# Altium schematic sheet V3s.SchDoc: V3s 原理图
size A3; Address1: 原理图 吴国才; Address2: PCB 吴国才; DocumentNumber: 3; Revision: V1.0; SheetNumber: 3; SheetTotal: 3
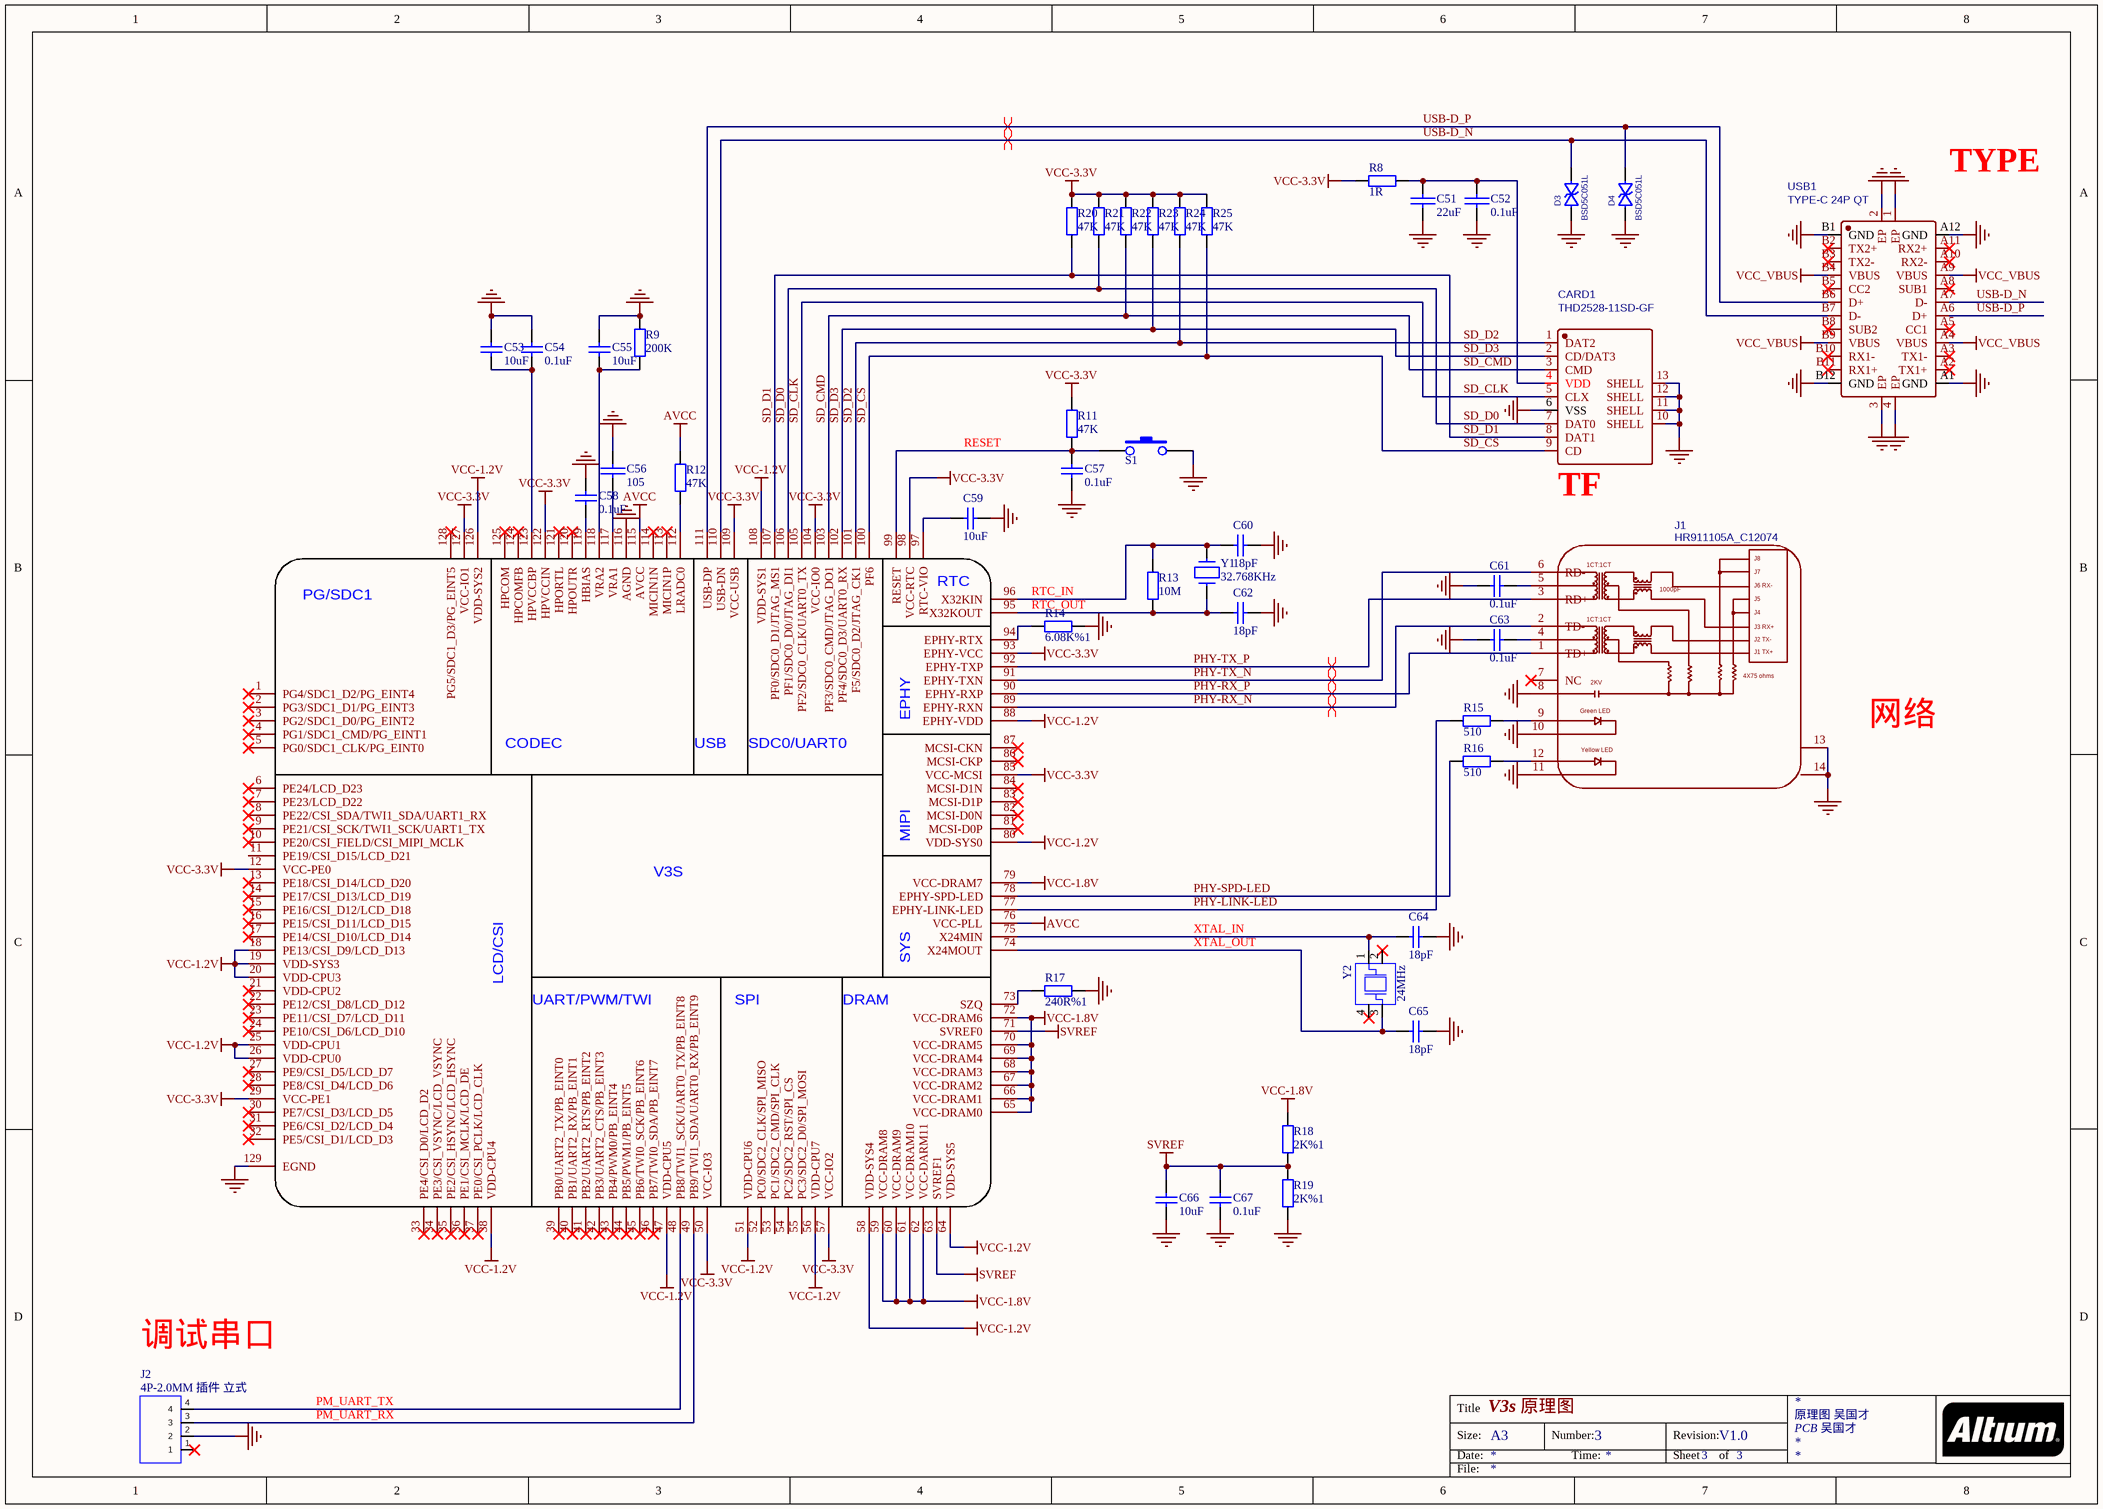
[diagram p0: V3s.SchDoc]

## Parts
C51  22uF  [0805_C]
C52  0.1uF  [0402_C]
C53  10uF  [0603_C]
C54  0.1uF  [0402_C]
C55  10uF  [0603_C]
C56  105  [0402_C]
C57  0.1uF  [0402_C]
C58  0.1uF  [0402_C]
C59  10uF  [0603_C]
C60  18pF  [0402_C]
C61  0.1uF  [0603_C]
C62  18pF  [0402_C]
C63  0.1uF  [0603_C]
C64  18pF  [0402_C]
C65  18pF  [0402_C]
C66  10uF  [0603_C]
C67  0.1uF  [0402_C]
CARD1  THD2528-11SD-GF  [TF-CARD-14.5X14.75X1.85MM]
D3  BSD5C051L  [SOD-523]
D4  BSD5C051L  [SOD-523]
J1  HR911105A_C12074  [HR913550A]
J2  4P-2.0MM 插件 立式  [Hole,4P=2.00MM]
R8  1R  [0402_R]
R9  200K  [0402_R]
R11  47K  [0402_R]
R12  47K  [0402_R]
R13  10M  [0402_R]
R14  6.08K%1  [0402_R]
R15  510  [0402_R]
R16  510  [0402_R]
R17  240R%1  [0402_R]
R18  2K%1  [0402_R]
R19  2K%1  [0402_R]
R20  47K  [0402_R]
R21  47K  [0402_R]
R22  47K  [0402_R]
R23  47K  [0402_R]
R24  47K  [0402_R]
R25  47K  [0402_R]
S1  SW-PB_1  [KEY-3X6-SMD]  (value not drawn)
USB1  TYPE-C 24P QT  [USB-C-SMD_TYPE-C-24P-QT]
V1  V3S  [QUAD128]  (value not drawn)
Y1  32.768KHz  [SMD3215-2P]
Y2  24MHz  [SMD3225-4P]

## Nets
AVCC: R12.1 V1.76(VCC-PLL) V1.115(AVCC)
GND: C51.1 C52.1 C53.2 C54.1 C55.2 C56.2 C57.2 C58.1 C59.2 C60.2 C61.2 C62.2 C63.2 C64.1 C65.1 C66.2 C67.2 CARD1.6(VSS) CARD1.10(SHELL) CARD1.11(SHELL) CARD1.12(SHELL) CARD1.13(SHELL) D3.1 D4.1 J1.8(CHS_GND) J1.10 J1.11 J1.13(SH1) J1.14(SH2) J2.2 R9.2 R14.2 R17.2 R19.2 S1.1 USB1.1(EP) USB1.2(EP) USB1.3(EP) USB1.4(EP) USB1.A1(GND) USB1.A12(GND) USB1.B1(GND) USB1.B12(GND) V1.116(AGND) V1.129(EGND)
SVREF: C66.1 C67.1 R18.2 R19.1 V1.63(SVREF1) V1.71(SVREF0)
VCC-1.2V: V1.18(PE13/CSI_D9/LCD_D13) V1.19(VDD-SYS3) V1.20(VDD-CPU3) V1.25(VDD-CPU1) V1.26(VDD-CPU0) V1.38(VDD-CPU4) V1.47(VDD-CPU5) V1.51(VDD-CPU6) V1.56(VDD-CPU7) V1.58(VDD-SYS4) V1.64(VDD-SYS5) V1.80(VDD-SYS0) V1.88(EPHY-VDD) V1.108(VDD-SYS1) V1.126(VDD-SYS2)
VCC-1.8V: R18.1 V1.59(VCC-DRAM8) V1.60(VCC-DRAM9) V1.61(VCC-DRAM10) V1.62(VCC-DARM11) V1.65(VCC-DRAM0) V1.66(VCC-DRAM1) V1.67(VCC-DRAM2) V1.68(VCC-DRAM3) V1.69(VCC-DRAM4) V1.70(VCC-DRAM5) V1.72(VCC-DRAM6) V1.79(VCC-DRAM7)
VCC-3.3V: R8.1 R11.1 R20.1 R21.1 R22.1 R23.1 R24.1 R25.1 V1.12(VCC-PE0) V1.29(VCC-PE1) V1.50(VCC-IO3) V1.57(VCC-IO2) V1.85(VCC-MCSI) V1.93(EPHY-VCC) V1.98(VCC-RTC) V1.104(VCC-IO0) V1.109(VCC-USB) V1.122(HPVCCIN) V1.127(VCC-IO1)
VCC_VBUS: USB1.A4(VBUS) USB1.A9(VBUS) USB1.B4(VBUS) USB1.B9(VBUS)
PHY-LINK-LED: R15.2 V1.77(EPHY-LINK-LED)
PHY-RX_N: J1.2(TD-) V1.89(EPHY-RXN)
PHY-RX_P: J1.1(TD+) V1.90(EPHY-RXP)
PHY-SPD-LED: R16.2 V1.78(EPHY-SPD-LED)
PHY-TX_N: J1.6(RD-) V1.91(EPHY-TXN)
PHY-TX_P: J1.3(RD+) V1.92(EPHY-TXP)
PM_UART_RX: J2.3 V1.49(PB9/TWI1_SDA/UART0_RX/PB_EINT9)
PM_UART_TX: J2.4 V1.48(PB8/TWI1_SCK/UART0_TX/PB_EINT8)
RESET: C57.1 R11.2 S1.2 V1.99(RESET)
RTC_IN: C60.1 R13.2 V1.96(X32KIN) Y1.2
RTC_OUT: C62.1 R13.1 V1.95(X32KOUT) Y1.1
SD_CLK: CARD1.5(CLX) V1.105(PF2/SDC0_CLK/UART0_TX)
SD_CMD: CARD1.3(CMD) R22.2 V1.103(PF3/SDC0_CMD/JTAG_DO1)
SD_CS: CARD1.9(CD) R25.2 V1.100(PF6)
SD_D0: CARD1.7(DAT0) R21.2 V1.106(PF1/SDC0_D0/JTAG_DI1)
SD_D1: CARD1.8(DAT1) R20.2 V1.107(PF0/SDC0_D1/JTAG_MS1)
SD_D2: CARD1.1(DAT2) R24.2 V1.101(F5/SDC0_D2/JTAG_CK1)
SD_D3: CARD1.2(CD/DAT3) R23.2 V1.102(PF4/SDC0_D3/UART0_RX)
USB-D_N: D3.2 USB1.A7(D-) USB1.B7(D-) V1.110(USB-DN)
USB-D_P: D4.2 USB1.A6(D+) USB1.B6(D+) V1.111(USB-DP)
XTAL_IN: C64.2 V1.75(X24MIN) Y2.1(CIN)
XTAL_OUT: C65.2 V1.74(X24MOUT) Y2.3(COUT)
NetC51_2: C51.2 C52.2 CARD1.4(VDD) R8.2
NetC53_1: C53.1 C54.2 V1.123(HPVCCBP)
NetC55_1: C55.1 R9.1 V1.118(VRA2)
NetC56_1: C56.1 V1.117(VRA1)
NetC58_2: C58.2 V1.119(HBIAS)
NetC59_1: C59.1 V1.97(RTC-VIO)
NetC61_1: C61.1 J1.5
NetC63_1: C63.1 J1.4
NetJ1_9: J1.9 R15.1
NetJ1_12: J1.12 R16.1
NetR12_2: R12.2 V1.112(LRADC0)
NetR14_1: R14.1 V1.94(EPHY-RTX)
NetR17_1: R17.1 V1.73(SZQ)

Not connected (* = marked no-connect by the designer): J1 7(NC)*; J2 1*; USB1 A2(TX1+)* A3(TX1-)* A5(CC1)* A8(SUB1)* A10(RX2-)* A11(RX2+)* B2(TX2+)* B3(TX2-)* B5(CC2)* B8(SUB2)* B10(RX1-)* B11(RX1+)*; V1 1(PG4/SDC1_D2/PG_EINT4)* 2(PG3/SDC1_D1/PG_EINT3)* 3(PG2/SDC1_D0/PG_EINT2)* 4(PG1/SDC1_CMD/PG_EINT1)* 5(PG0/SDC1_CLK/PG_EINT0)* 6(PE24/LCD_D23)* 7(PE23/LCD_D22)* 8(PE22/CSI_SDA/TWI1_SDA/UART1_RX)* 9(PE21/CSI_SCK/TWI1_SCK/UART1_TX)* 10(PE20/CSI_FIELD/CSI_MIPI_MCLK)* 11(PE19/CSI_D15/LCD_D21) 13(PE18/CSI_D14/LCD_D20)* 14(PE17/CSI_D13/LCD_D19)* 15(PE16/CSI_D12/LCD_D18)* 16(PE15/CSI_D11/LCD_D15)* 17(PE14/CSI_D10/LCD_D14)* 21(VDD-CPU2)* 22(PE12/CSI_D8/LCD_D12)* 23(PE11/CSI_D7/LCD_D11)* 24(PE10/CSI_D6/LCD_D10)* 27(PE9/CSI_D5/LCD_D7)* 28(PE8/CSI_D4/LCD_D6)* 30(PE7/CSI_D3/LCD_D5)* 31(PE6/CSI_D2/LCD_D4)* 32(PE5/CSI_D1/LCD_D3)* 33(PE4/CSI_D0/LCD_D2)* 34(PE3/CSI_VSYNC/LCD_VSYNC)* 35(PE2/CSI_HSYNC/LCD_HSYNC)* 36(PE1/CSI_MCLK/LCD_DE)* 37(PE0/CSI_PCLK/LCD_CLK)* 39(PB0/UART2_TX/PB_EINT0)* 40(PB1/UART2_RX/PB_EINT1)* 41(PB2/UART2_RTS/PB_EINT2)* 42(PB3/UART2_CTS/PB_EINT3)* 43(PB4/PWM0/PB_EINT4)* 44(PB5/PWM1/PB_EINT5)* 45(PB6/TWI0_SCK/PB_EINT6)* 46(PB7/TWI0_SDA/PB_EINT7)* 52(PC0/SDC2_CLK/SPI_MISO) 53(PC1/SDC2_CMD/SPI_CLK) 54(PC2/SDC2_RST/SPI_CS) 55(PC3/SDC2_D0/SPI_MOSI) 81(MCSI-D0P)* 82(MCSI-D0N)* 83(MCSI-D1P)* 84(MCSI-D1N)* 86(MCSI-CKP)* 87(MCSI-CKN)* 113(MICIN1P)* 114(MICIN1N)* 120(HPOUTR)* 121(HPORTL)* 124(HPCOMFB)* 125(HPCOM)* 128(PG5/SDC1_D3/PG_EINT5)*; Y2 2* 4*

## Layout directives
differential pair: PHY-RX_N, PHY-RX_P, PHY-TX_N, PHY-TX_P, USB-D_N, USB-D_P

## Notes on the sheet
- (near USB1) TYPE
- (near CARD1) TF
- 网络
- 调试串口
- Title
- Size:
- Date:
- A3
- Number:
- Time:
- Revision:
- Sheet
- of
- File:
- (in symbol HR911105A_C12074) J8; 1CT:1CT; J7; 1000pF; J6 RX-; J5; J4; J3 RX+; J2 TX-; J1 TX+; 4X75 ohms; 2KV; Green LED; Yellow LED
- (in symbol V3S) RTC; PG/SDC1; EPHY; CODEC; USB; SDC0/UART0; MIPI; SYS; LCD/CSI; UART/PWM/TWI; SPI; DRAM

## Library data of the parts
C51 C52 C56 = CAP: 贴片电容; value: 贴片电容/105 ±10% 50V X7R 编带 封装规格：0603
C53-C55 C57-C59 C61 C63-C67 = 036960: 贴片电容; 存货编码: 036960; 产品型名: CC0603KRX7R9BB104(C0603-104K/50V); 品牌: YAGEO; 封装: 0603; 品名: 电容器
C60 C62 = CAP-SMD: 贴片电容
CARD1 = THD2528-11SD-GF: BOM_Manufacturer: THD; Contributor: LCSC; BOM_Supplier: LCSC; BOM_Supplier Part: C283232; BOM_Manufacturer Part: THD2528-11SD-GF; BOM_JLCPCB Part Class: Extended Part; spicePre: C; spiceSymbolName: THD2528-11SD-GF
D3 D4 = DIODE_ESD: PCB DECAL: 0402; Value: BSD5C051L
J1 = HR911105A_C12074: BOM_Manufacturer: HANRUN; BOM_Supplier: LCSC; BOM_Manufacturer Part: HR911105A; BOM_Supplier Part: C12074; BOM_JLCPCB Part Class: Extended Part; spicePre: J; spiceSymbolName: HR911105A_C12074
J2 = CON-4P: 插件-立式插座; PCB DECAL: 2.5-4P; Source_Path: E:\JIANG\二代产品开发资料\设计参考\A20CORNEL\LIBRARY1.OLB; Value: 2.54-4P-WDIP
R8 R9 R11-R25 = Res2: 贴片电阻; value: 贴片电阻/10KΩ ±5% 编带 封装规格：0603
USB1 = TYPE-C 24P QT: C2681555 品牌： SHOU HAN(首韩); Contributor: LCSC; BOM_Supplier: LCSC; BOM_Supplier Part: C2681555; BOM_Manufacturer: SHOU HAN(首韩); BOM_Manufacturer Part: TYPE-C 24P QT; BOM_JLCPCB Part Class: Extended Part; spicePre: U; spiceSymbolName: TYPE-C 24P QT
V1 = V3S: Contributor: cnicfhnui; Package Display: No; spicePre: U
Y1 = CRYSTAL-C: 时钟晶体 32.768kHz 12.5PF 20PPM
Y2 = CRYSTAL4P_2: 贴片无源晶振; SPE: ±20ppm-12pF/-40℃～+85℃---3225; PCB DECAL: SX4-3225-1; VALUE: 12MHz; PCB: 3225